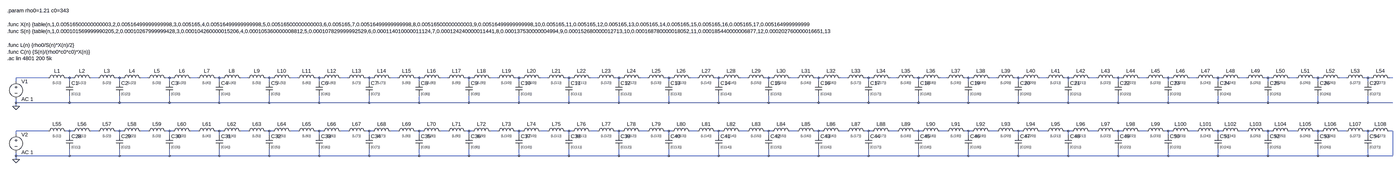
[diagram p0: schematic AC -220722 - Horn.asc, whole sheet]
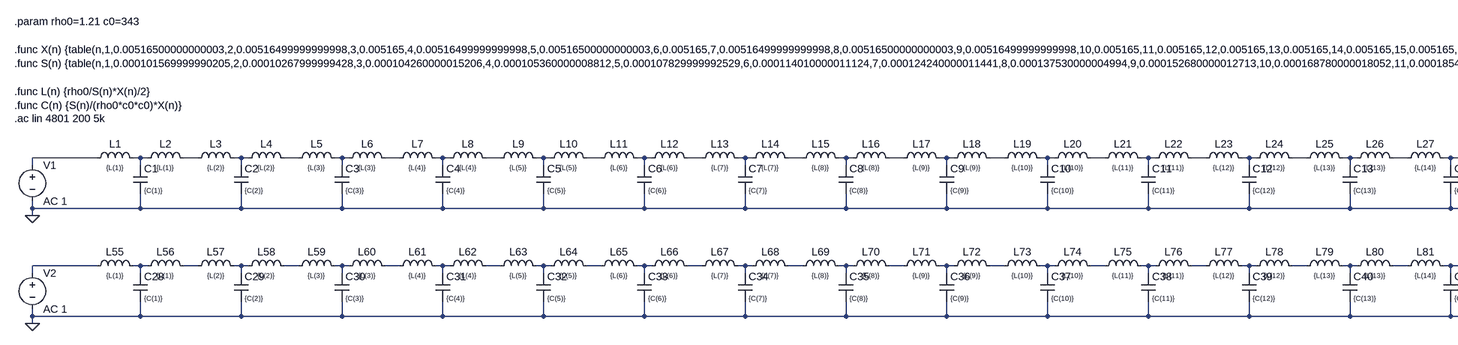
[diagram p1: schematic AC -220722 - Horn.asc, part, row 1 of 1, column 1 of 2]
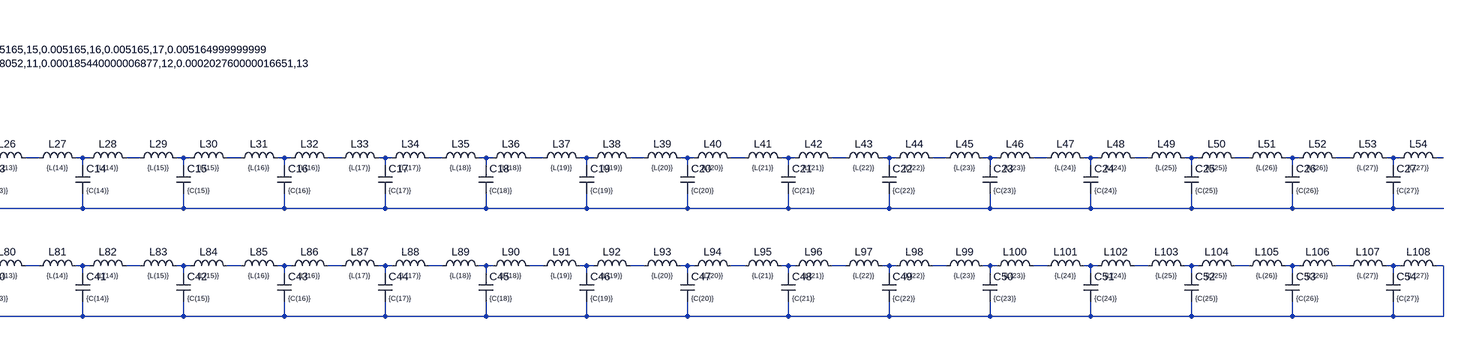
[diagram p2: schematic AC -220722 - Horn.asc, part, row 1 of 1, column 2 of 2]
AC -220722 - Horn.asc, the LTspice schematic file:
Version 4
SHEET 1 9596 1048
WIRE 224 416 80 416
WIRE 320 416 304 416
WIRE 336 416 320 416
WIRE 448 416 416 416
WIRE 544 416 528 416
WIRE 560 416 544 416
WIRE 672 416 640 416
WIRE 768 416 752 416
WIRE 784 416 768 416
WIRE 896 416 864 416
WIRE 992 416 976 416
WIRE 1008 416 992 416
WIRE 1120 416 1088 416
WIRE 1216 416 1200 416
WIRE 1232 416 1216 416
WIRE 1344 416 1312 416
WIRE 1440 416 1424 416
WIRE 1456 416 1440 416
WIRE 1568 416 1536 416
WIRE 1664 416 1648 416
WIRE 1680 416 1664 416
WIRE 1792 416 1760 416
WIRE 1888 416 1872 416
WIRE 1904 416 1888 416
WIRE 2016 416 1984 416
WIRE 2112 416 2096 416
WIRE 2128 416 2112 416
WIRE 2240 416 2208 416
WIRE 2336 416 2320 416
WIRE 2352 416 2336 416
WIRE 2464 416 2432 416
WIRE 2560 416 2544 416
WIRE 2576 416 2560 416
WIRE 2688 416 2656 416
WIRE 2784 416 2768 416
WIRE 2800 416 2784 416
WIRE 2912 416 2880 416
WIRE 3008 416 2992 416
WIRE 3024 416 3008 416
WIRE 3136 416 3104 416
WIRE 3232 416 3216 416
WIRE 3248 416 3232 416
WIRE 3360 416 3328 416
WIRE 3456 416 3440 416
WIRE 3472 416 3456 416
WIRE 3584 416 3552 416
WIRE 3680 416 3664 416
WIRE 3696 416 3680 416
WIRE 3808 416 3776 416
WIRE 3904 416 3888 416
WIRE 3920 416 3904 416
WIRE 4032 416 4000 416
WIRE 4128 416 4112 416
WIRE 4144 416 4128 416
WIRE 4256 416 4224 416
WIRE 4352 416 4336 416
WIRE 4368 416 4352 416
WIRE 4480 416 4448 416
WIRE 4576 416 4560 416
WIRE 4592 416 4576 416
WIRE 4704 416 4672 416
WIRE 4800 416 4784 416
WIRE 4816 416 4800 416
WIRE 4928 416 4896 416
WIRE 5024 416 5008 416
WIRE 5040 416 5024 416
WIRE 5152 416 5120 416
WIRE 5248 416 5232 416
WIRE 5264 416 5248 416
WIRE 5376 416 5344 416
WIRE 5472 416 5456 416
WIRE 5488 416 5472 416
WIRE 5600 416 5568 416
WIRE 5696 416 5680 416
WIRE 5712 416 5696 416
WIRE 5824 416 5792 416
WIRE 5920 416 5904 416
WIRE 5936 416 5920 416
WIRE 6048 416 6016 416
WIRE 6144 416 6128 416
WIRE 6160 416 6144 416
WIRE 6256 416 6240 416
WIRE 80 432 80 416
WIRE 320 432 320 416
WIRE 544 432 544 416
WIRE 768 432 768 416
WIRE 992 432 992 416
WIRE 1216 432 1216 416
WIRE 1440 432 1440 416
WIRE 1664 432 1664 416
WIRE 1888 432 1888 416
WIRE 2112 432 2112 416
WIRE 2336 432 2336 416
WIRE 2560 432 2560 416
WIRE 2784 432 2784 416
WIRE 3008 432 3008 416
WIRE 3232 432 3232 416
WIRE 3456 432 3456 416
WIRE 3680 432 3680 416
WIRE 3904 432 3904 416
WIRE 4128 432 4128 416
WIRE 4352 432 4352 416
WIRE 4576 432 4576 416
WIRE 4800 432 4800 416
WIRE 5024 432 5024 416
WIRE 5248 432 5248 416
WIRE 5472 432 5472 416
WIRE 5696 432 5696 416
WIRE 5920 432 5920 416
WIRE 6144 432 6144 416
WIRE 80 528 80 512
WIRE 320 528 320 496
WIRE 320 528 80 528
WIRE 544 528 544 496
WIRE 544 528 320 528
WIRE 768 528 768 496
WIRE 768 528 544 528
WIRE 992 528 992 496
WIRE 992 528 768 528
WIRE 1216 528 1216 496
WIRE 1216 528 992 528
WIRE 1440 528 1440 496
WIRE 1440 528 1216 528
WIRE 1664 528 1664 496
WIRE 1664 528 1440 528
WIRE 1888 528 1888 496
WIRE 1888 528 1664 528
WIRE 2112 528 2112 496
WIRE 2112 528 1888 528
WIRE 2336 528 2336 496
WIRE 2336 528 2112 528
WIRE 2560 528 2560 496
WIRE 2560 528 2336 528
WIRE 2784 528 2784 496
WIRE 2784 528 2560 528
WIRE 3008 528 3008 496
WIRE 3008 528 2784 528
WIRE 3232 528 3232 496
WIRE 3232 528 3008 528
WIRE 3456 528 3456 496
WIRE 3456 528 3232 528
WIRE 3680 528 3680 496
WIRE 3680 528 3456 528
WIRE 3904 528 3904 496
WIRE 3904 528 3680 528
WIRE 4128 528 4128 496
WIRE 4128 528 3904 528
WIRE 4352 528 4352 496
WIRE 4352 528 4128 528
WIRE 4576 528 4576 496
WIRE 4576 528 4352 528
WIRE 4800 528 4800 496
WIRE 4800 528 4576 528
WIRE 5024 528 5024 496
WIRE 5024 528 4800 528
WIRE 5248 528 5248 496
WIRE 5248 528 5024 528
WIRE 5472 528 5472 496
WIRE 5472 528 5248 528
WIRE 5696 528 5696 496
WIRE 5696 528 5472 528
WIRE 5920 528 5920 496
WIRE 5920 528 5696 528
WIRE 6144 528 6144 496
WIRE 6144 528 5920 528
WIRE 6256 528 6144 528
WIRE 80 544 80 528
WIRE 224 656 80 656
WIRE 320 656 304 656
WIRE 336 656 320 656
WIRE 448 656 416 656
WIRE 544 656 528 656
WIRE 560 656 544 656
WIRE 672 656 640 656
WIRE 768 656 752 656
WIRE 784 656 768 656
WIRE 896 656 864 656
WIRE 992 656 976 656
WIRE 1008 656 992 656
WIRE 1120 656 1088 656
WIRE 1216 656 1200 656
WIRE 1232 656 1216 656
WIRE 1344 656 1312 656
WIRE 1440 656 1424 656
WIRE 1456 656 1440 656
WIRE 1568 656 1536 656
WIRE 1664 656 1648 656
WIRE 1680 656 1664 656
WIRE 1792 656 1760 656
WIRE 1888 656 1872 656
WIRE 1904 656 1888 656
WIRE 2016 656 1984 656
WIRE 2112 656 2096 656
WIRE 2128 656 2112 656
WIRE 2240 656 2208 656
WIRE 2336 656 2320 656
WIRE 2352 656 2336 656
WIRE 2464 656 2432 656
WIRE 2560 656 2544 656
WIRE 2576 656 2560 656
WIRE 2688 656 2656 656
WIRE 2784 656 2768 656
WIRE 2800 656 2784 656
WIRE 2912 656 2880 656
WIRE 3008 656 2992 656
WIRE 3024 656 3008 656
WIRE 3136 656 3104 656
WIRE 3232 656 3216 656
WIRE 3248 656 3232 656
WIRE 3360 656 3328 656
WIRE 3456 656 3440 656
WIRE 3472 656 3456 656
WIRE 3584 656 3552 656
WIRE 3680 656 3664 656
WIRE 3696 656 3680 656
WIRE 3808 656 3776 656
WIRE 3904 656 3888 656
WIRE 3920 656 3904 656
WIRE 4032 656 4000 656
WIRE 4128 656 4112 656
WIRE 4144 656 4128 656
WIRE 4256 656 4224 656
WIRE 4352 656 4336 656
WIRE 4368 656 4352 656
WIRE 4480 656 4448 656
WIRE 4576 656 4560 656
WIRE 4592 656 4576 656
WIRE 4704 656 4672 656
WIRE 4800 656 4784 656
WIRE 4816 656 4800 656
WIRE 4928 656 4896 656
WIRE 5024 656 5008 656
WIRE 5040 656 5024 656
WIRE 5152 656 5120 656
WIRE 5248 656 5232 656
WIRE 5264 656 5248 656
WIRE 5376 656 5344 656
WIRE 5472 656 5456 656
WIRE 5488 656 5472 656
WIRE 5600 656 5568 656
WIRE 5696 656 5680 656
WIRE 5712 656 5696 656
WIRE 5824 656 5792 656
WIRE 5920 656 5904 656
WIRE 5936 656 5920 656
WIRE 6048 656 6016 656
WIRE 6144 656 6128 656
WIRE 6160 656 6144 656
WIRE 6256 656 6240 656
WIRE 80 672 80 656
WIRE 320 672 320 656
WIRE 544 672 544 656
WIRE 768 672 768 656
WIRE 992 672 992 656
WIRE 1216 672 1216 656
WIRE 1440 672 1440 656
WIRE 1664 672 1664 656
WIRE 1888 672 1888 656
WIRE 2112 672 2112 656
WIRE 2336 672 2336 656
WIRE 2560 672 2560 656
WIRE 2784 672 2784 656
WIRE 3008 672 3008 656
WIRE 3232 672 3232 656
WIRE 3456 672 3456 656
WIRE 3680 672 3680 656
WIRE 3904 672 3904 656
WIRE 4128 672 4128 656
WIRE 4352 672 4352 656
WIRE 4576 672 4576 656
WIRE 4800 672 4800 656
WIRE 5024 672 5024 656
WIRE 5248 672 5248 656
WIRE 5472 672 5472 656
WIRE 5696 672 5696 656
WIRE 5920 672 5920 656
WIRE 6144 672 6144 656
WIRE 80 768 80 752
WIRE 320 768 320 736
WIRE 320 768 80 768
WIRE 544 768 544 736
WIRE 544 768 320 768
WIRE 768 768 768 736
WIRE 768 768 544 768
WIRE 992 768 992 736
WIRE 992 768 768 768
WIRE 1216 768 1216 736
WIRE 1216 768 992 768
WIRE 1440 768 1440 736
WIRE 1440 768 1216 768
WIRE 1664 768 1664 736
WIRE 1664 768 1440 768
WIRE 1888 768 1888 736
WIRE 1888 768 1664 768
WIRE 2112 768 2112 736
WIRE 2112 768 1888 768
WIRE 2336 768 2336 736
WIRE 2336 768 2112 768
WIRE 2560 768 2560 736
WIRE 2560 768 2336 768
WIRE 2784 768 2784 736
WIRE 2784 768 2560 768
WIRE 3008 768 3008 736
WIRE 3008 768 2784 768
WIRE 3232 768 3232 736
WIRE 3232 768 3008 768
WIRE 3456 768 3456 736
WIRE 3456 768 3232 768
WIRE 3680 768 3680 736
WIRE 3680 768 3456 768
WIRE 3904 768 3904 736
WIRE 3904 768 3680 768
WIRE 4128 768 4128 736
WIRE 4128 768 3904 768
WIRE 4352 768 4352 736
WIRE 4352 768 4128 768
WIRE 4576 768 4576 736
WIRE 4576 768 4352 768
WIRE 4800 768 4800 736
WIRE 4800 768 4576 768
WIRE 5024 768 5024 736
WIRE 5024 768 4800 768
WIRE 5248 768 5248 736
WIRE 5248 768 5024 768
WIRE 5472 768 5472 736
WIRE 5472 768 5248 768
WIRE 5696 768 5696 736
WIRE 5696 768 5472 768
WIRE 5920 768 5920 736
WIRE 5920 768 5696 768
WIRE 6144 768 6144 736
WIRE 6144 768 5920 768
WIRE 6256 768 6256 656
WIRE 6256 768 6144 768
WIRE 80 784 80 768
FLAG 80 544 0
FLAG 80 784 0
SYMBOL voltage 80 416 R0
SYMATTR InstName V1
SYMATTR Value AC 1
SYMBOL ind 208 432 R270
WINDOW 0 32 56 VTop 2
WINDOW 3 5 56 VBottom 1
SYMATTR InstName L1
SYMATTR Value {L(1)}
SYMBOL ind 320 432 R270
WINDOW 0 32 56 VTop 2
WINDOW 3 5 56 VBottom 1
SYMATTR InstName L2
SYMATTR Value {L(1)}
SYMBOL cap 304 432 R0
WINDOW 3 24 56 Left 1
SYMATTR Value {C(1)}
SYMATTR InstName C1
SYMBOL ind 432 432 R270
WINDOW 0 32 56 VTop 2
WINDOW 3 5 56 VBottom 1
SYMATTR InstName L3
SYMATTR Value {L(2)}
SYMBOL ind 544 432 R270
WINDOW 0 32 56 VTop 2
WINDOW 3 5 56 VBottom 1
SYMATTR InstName L4
SYMATTR Value {L(2)}
SYMBOL cap 528 432 R0
WINDOW 3 24 56 Left 1
SYMATTR Value {C(2)}
SYMATTR InstName C2
SYMBOL ind 656 432 R270
WINDOW 0 32 56 VTop 2
WINDOW 3 5 56 VBottom 1
SYMATTR InstName L5
SYMATTR Value {L(3)}
SYMBOL ind 768 432 R270
WINDOW 0 32 56 VTop 2
WINDOW 3 5 56 VBottom 1
SYMATTR InstName L6
SYMATTR Value {L(3)}
SYMBOL cap 752 432 R0
WINDOW 3 24 56 Left 1
SYMATTR Value {C(3)}
SYMATTR InstName C3
SYMBOL ind 880 432 R270
WINDOW 0 32 56 VTop 2
WINDOW 3 5 56 VBottom 1
SYMATTR InstName L7
SYMATTR Value {L(4)}
SYMBOL ind 992 432 R270
WINDOW 0 32 56 VTop 2
WINDOW 3 5 56 VBottom 1
SYMATTR InstName L8
SYMATTR Value {L(4)}
SYMBOL cap 976 432 R0
WINDOW 3 24 56 Left 1
SYMATTR Value {C(4)}
SYMATTR InstName C4
SYMBOL ind 1104 432 R270
WINDOW 0 32 56 VTop 2
WINDOW 3 5 56 VBottom 1
SYMATTR InstName L9
SYMATTR Value {L(5)}
SYMBOL ind 1216 432 R270
WINDOW 0 32 56 VTop 2
WINDOW 3 5 56 VBottom 1
SYMATTR InstName L10
SYMATTR Value {L(5)}
SYMBOL cap 1200 432 R0
WINDOW 3 24 56 Left 1
SYMATTR Value {C(5)}
SYMATTR InstName C5
SYMBOL ind 1328 432 R270
WINDOW 0 32 56 VTop 2
WINDOW 3 5 56 VBottom 1
SYMATTR InstName L11
SYMATTR Value {L(6)}
SYMBOL ind 1440 432 R270
WINDOW 0 32 56 VTop 2
WINDOW 3 5 56 VBottom 1
SYMATTR InstName L12
SYMATTR Value {L(6)}
SYMBOL cap 1424 432 R0
WINDOW 3 24 56 Left 1
SYMATTR Value {C(6)}
SYMATTR InstName C6
SYMBOL ind 1552 432 R270
WINDOW 0 32 56 VTop 2
WINDOW 3 5 56 VBottom 1
SYMATTR InstName L13
SYMATTR Value {L(7)}
SYMBOL ind 1664 432 R270
WINDOW 0 32 56 VTop 2
WINDOW 3 5 56 VBottom 1
SYMATTR InstName L14
SYMATTR Value {L(7)}
SYMBOL cap 1648 432 R0
WINDOW 3 24 56 Left 1
SYMATTR Value {C(7)}
SYMATTR InstName C7
SYMBOL ind 1776 432 R270
WINDOW 0 32 56 VTop 2
WINDOW 3 5 56 VBottom 1
SYMATTR InstName L15
SYMATTR Value {L(8)}
SYMBOL ind 1888 432 R270
WINDOW 0 32 56 VTop 2
WINDOW 3 5 56 VBottom 1
SYMATTR InstName L16
SYMATTR Value {L(8)}
SYMBOL cap 1872 432 R0
WINDOW 3 24 56 Left 1
SYMATTR Value {C(8)}
SYMATTR InstName C8
SYMBOL ind 2000 432 R270
WINDOW 0 32 56 VTop 2
WINDOW 3 5 56 VBottom 1
SYMATTR InstName L17
SYMATTR Value {L(9)}
SYMBOL ind 2112 432 R270
WINDOW 0 32 56 VTop 2
WINDOW 3 5 56 VBottom 1
SYMATTR InstName L18
SYMATTR Value {L(9)}
SYMBOL cap 2096 432 R0
WINDOW 3 24 56 Left 1
SYMATTR Value {C(9)}
SYMATTR InstName C9
SYMBOL ind 2224 432 R270
WINDOW 0 32 56 VTop 2
WINDOW 3 5 56 VBottom 1
SYMATTR InstName L19
SYMATTR Value {L(10)}
SYMBOL ind 2336 432 R270
WINDOW 0 32 56 VTop 2
WINDOW 3 5 56 VBottom 1
SYMATTR InstName L20
SYMATTR Value {L(10)}
SYMBOL cap 2320 432 R0
WINDOW 3 24 56 Left 1
SYMATTR Value {C(10)}
SYMATTR InstName C10
SYMBOL ind 2448 432 R270
WINDOW 0 32 56 VTop 2
WINDOW 3 5 56 VBottom 1
SYMATTR InstName L21
SYMATTR Value {L(11)}
SYMBOL ind 2560 432 R270
WINDOW 0 32 56 VTop 2
WINDOW 3 5 56 VBottom 1
SYMATTR InstName L22
SYMATTR Value {L(11)}
SYMBOL cap 2544 432 R0
WINDOW 3 24 56 Left 1
SYMATTR Value {C(11)}
SYMATTR InstName C11
SYMBOL ind 2672 432 R270
WINDOW 0 32 56 VTop 2
WINDOW 3 5 56 VBottom 1
SYMATTR InstName L23
SYMATTR Value {L(12)}
SYMBOL ind 2784 432 R270
WINDOW 0 32 56 VTop 2
WINDOW 3 5 56 VBottom 1
SYMATTR InstName L24
SYMATTR Value {L(12)}
SYMBOL cap 2768 432 R0
WINDOW 3 24 56 Left 1
SYMATTR Value {C(12)}
SYMATTR InstName C12
SYMBOL ind 2896 432 R270
WINDOW 0 32 56 VTop 2
WINDOW 3 5 56 VBottom 1
SYMATTR InstName L25
SYMATTR Value {L(13)}
SYMBOL ind 3008 432 R270
WINDOW 0 32 56 VTop 2
WINDOW 3 5 56 VBottom 1
SYMATTR InstName L26
SYMATTR Value {L(13)}
SYMBOL cap 2992 432 R0
WINDOW 3 24 56 Left 1
SYMATTR Value {C(13)}
SYMATTR InstName C13
SYMBOL ind 3120 432 R270
WINDOW 0 32 56 VTop 2
WINDOW 3 5 56 VBottom 1
SYMATTR InstName L27
SYMATTR Value {L(14)}
SYMBOL ind 3232 432 R270
WINDOW 0 32 56 VTop 2
WINDOW 3 5 56 VBottom 1
SYMATTR InstName L28
SYMATTR Value {L(14)}
SYMBOL cap 3216 432 R0
WINDOW 3 24 56 Left 1
SYMATTR Value {C(14)}
SYMATTR InstName C14
SYMBOL ind 3344 432 R270
WINDOW 0 32 56 VTop 2
WINDOW 3 5 56 VBottom 1
SYMATTR InstName L29
SYMATTR Value {L(15)}
SYMBOL ind 3456 432 R270
WINDOW 0 32 56 VTop 2
WINDOW 3 5 56 VBottom 1
SYMATTR InstName L30
SYMATTR Value {L(15)}
SYMBOL cap 3440 432 R0
WINDOW 3 24 56 Left 1
SYMATTR Value {C(15)}
SYMATTR InstName C15
SYMBOL ind 3568 432 R270
WINDOW 0 32 56 VTop 2
WINDOW 3 5 56 VBottom 1
SYMATTR InstName L31
SYMATTR Value {L(16)}
SYMBOL ind 3680 432 R270
WINDOW 0 32 56 VTop 2
WINDOW 3 5 56 VBottom 1
SYMATTR InstName L32
SYMATTR Value {L(16)}
SYMBOL cap 3664 432 R0
WINDOW 3 24 56 Left 1
SYMATTR Value {C(16)}
SYMATTR InstName C16
SYMBOL ind 3792 432 R270
WINDOW 0 32 56 VTop 2
WINDOW 3 5 56 VBottom 1
SYMATTR InstName L33
SYMATTR Value {L(17)}
SYMBOL ind 3904 432 R270
WINDOW 0 32 56 VTop 2
WINDOW 3 5 56 VBottom 1
SYMATTR InstName L34
SYMATTR Value {L(17)}
SYMBOL cap 3888 432 R0
WINDOW 3 24 56 Left 1
SYMATTR Value {C(17)}
SYMATTR InstName C17
SYMBOL ind 4016 432 R270
WINDOW 0 32 56 VTop 2
WINDOW 3 5 56 VBottom 1
SYMATTR InstName L35
SYMATTR Value {L(18)}
SYMBOL ind 4128 432 R270
WINDOW 0 32 56 VTop 2
WINDOW 3 5 56 VBottom 1
SYMATTR InstName L36
SYMATTR Value {L(18)}
SYMBOL cap 4112 432 R0
WINDOW 3 24 56 Left 1
SYMATTR Value {C(18)}
SYMATTR InstName C18
SYMBOL ind 4240 432 R270
WINDOW 0 32 56 VTop 2
WINDOW 3 5 56 VBottom 1
SYMATTR InstName L37
SYMATTR Value {L(19)}
SYMBOL ind 4352 432 R270
WINDOW 0 32 56 VTop 2
WINDOW 3 5 56 VBottom 1
SYMATTR InstName L38
SYMATTR Value {L(19)}
SYMBOL cap 4336 432 R0
WINDOW 3 24 56 Left 1
SYMATTR Value {C(19)}
SYMATTR InstName C19
SYMBOL ind 4464 432 R270
WINDOW 0 32 56 VTop 2
WINDOW 3 5 56 VBottom 1
SYMATTR InstName L39
SYMATTR Value {L(20)}
SYMBOL ind 4576 432 R270
WINDOW 0 32 56 VTop 2
WINDOW 3 5 56 VBottom 1
SYMATTR InstName L40
SYMATTR Value {L(20)}
SYMBOL cap 4560 432 R0
WINDOW 3 24 56 Left 1
SYMATTR Value {C(20)}
SYMATTR InstName C20
SYMBOL ind 4688 432 R270
WINDOW 0 32 56 VTop 2
WINDOW 3 5 56 VBottom 1
SYMATTR InstName L41
SYMATTR Value {L(21)}
SYMBOL ind 4800 432 R270
WINDOW 0 32 56 VTop 2
WINDOW 3 5 56 VBottom 1
SYMATTR InstName L42
SYMATTR Value {L(21)}
SYMBOL cap 4784 432 R0
WINDOW 3 24 56 Left 1
SYMATTR Value {C(21)}
SYMATTR InstName C21
SYMBOL ind 4912 432 R270
WINDOW 0 32 56 VTop 2
WINDOW 3 5 56 VBottom 1
SYMATTR InstName L43
SYMATTR Value {L(22)}
SYMBOL ind 5024 432 R270
WINDOW 0 32 56 VTop 2
WINDOW 3 5 56 VBottom 1
SYMATTR InstName L44
SYMATTR Value {L(22)}
SYMBOL cap 5008 432 R0
WINDOW 3 24 56 Left 1
SYMATTR Value {C(22)}
SYMATTR InstName C22
SYMBOL ind 5136 432 R270
WINDOW 0 32 56 VTop 2
WINDOW 3 5 56 VBottom 1
SYMATTR InstName L45
SYMATTR Value {L(23)}
SYMBOL ind 5248 432 R270
WINDOW 0 32 56 VTop 2
WINDOW 3 5 56 VBottom 1
SYMATTR InstName L46
SYMATTR Value {L(23)}
SYMBOL cap 5232 432 R0
WINDOW 3 24 56 Left 1
SYMATTR Value {C(23)}
SYMATTR InstName C23
SYMBOL ind 5360 432 R270
WINDOW 0 32 56 VTop 2
WINDOW 3 5 56 VBottom 1
SYMATTR InstName L47
SYMATTR Value {L(24)}
SYMBOL ind 5472 432 R270
WINDOW 0 32 56 VTop 2
WINDOW 3 5 56 VBottom 1
SYMATTR InstName L48
SYMATTR Value {L(24)}
SYMBOL cap 5456 432 R0
WINDOW 3 24 56 Left 1
SYMATTR Value {C(24)}
SYMATTR InstName C24
SYMBOL ind 5584 432 R270
WINDOW 0 32 56 VTop 2
WINDOW 3 5 56 VBottom 1
SYMATTR InstName L49
SYMATTR Value {L(25)}
SYMBOL ind 5696 432 R270
WINDOW 0 32 56 VTop 2
WINDOW 3 5 56 VBottom 1
SYMATTR InstName L50
SYMATTR Value {L(25)}
SYMBOL cap 5680 432 R0
WINDOW 3 24 56 Left 1
SYMATTR Value {C(25)}
SYMATTR InstName C25
SYMBOL ind 5808 432 R270
WINDOW 0 32 56 VTop 2
WINDOW 3 5 56 VBottom 1
SYMATTR InstName L51
SYMATTR Value {L(26)}
SYMBOL ind 5920 432 R270
WINDOW 0 32 56 VTop 2
WINDOW 3 5 56 VBottom 1
SYMATTR InstName L52
SYMATTR Value {L(26)}
SYMBOL cap 5904 432 R0
WINDOW 3 24 56 Left 1
SYMATTR Value {C(26)}
SYMATTR InstName C26
SYMBOL ind 6032 432 R270
WINDOW 0 32 56 VTop 2
WINDOW 3 5 56 VBottom 1
SYMATTR InstName L53
SYMATTR Value {L(27)}
SYMBOL ind 6144 432 R270
WINDOW 0 32 56 VTop 2
WINDOW 3 5 56 VBottom 1
SYMATTR InstName L54
SYMATTR Value {L(27)}
SYMBOL cap 6128 432 R0
WINDOW 3 24 56 Left 1
SYMATTR Value {C(27)}
SYMATTR InstName C27
SYMBOL voltage 80 656 R0
SYMATTR InstName V2
SYMATTR Value AC 1
SYMBOL ind 208 672 R270
WINDOW 0 32 56 VTop 2
WINDOW 3 5 56 VBottom 1
SYMATTR InstName L55
SYMATTR Value {L(1)}
SYMBOL ind 320 672 R270
WINDOW 0 32 56 VTop 2
WINDOW 3 5 56 VBottom 1
SYMATTR InstName L56
SYMATTR Value {L(1)}
SYMBOL cap 304 672 R0
WINDOW 3 24 56 Left 1
SYMATTR Value {C(1)}
SYMATTR InstName C28
SYMBOL ind 432 672 R270
WINDOW 0 32 56 VTop 2
WINDOW 3 5 56 VBottom 1
SYMATTR InstName L57
SYMATTR Value {L(2)}
SYMBOL ind 544 672 R270
WINDOW 0 32 56 VTop 2
WINDOW 3 5 56 VBottom 1
SYMATTR InstName L58
SYMATTR Value {L(2)}
SYMBOL cap 528 672 R0
WINDOW 3 24 56 Left 1
SYMATTR Value {C(2)}
SYMATTR InstName C29
SYMBOL ind 656 672 R270
WINDOW 0 32 56 VTop 2
WINDOW 3 5 56 VBottom 1
SYMATTR InstName L59
SYMATTR Value {L(3)}
SYMBOL ind 768 672 R270
WINDOW 0 32 56 VTop 2
WINDOW 3 5 56 VBottom 1
SYMATTR InstName L60
SYMATTR Value {L(3)}
SYMBOL cap 752 672 R0
WINDOW 3 24 56 Left 1
SYMATTR Value {C(3)}
SYMATTR InstName C30
SYMBOL ind 880 672 R270
WINDOW 0 32 56 VTop 2
WINDOW 3 5 56 VBottom 1
SYMATTR InstName L61
SYMATTR Value {L(4)}
SYMBOL ind 992 672 R270
WINDOW 0 32 56 VTop 2
WINDOW 3 5 56 VBottom 1
SYMATTR InstName L62
SYMATTR Value {L(4)}
SYMBOL cap 976 672 R0
WINDOW 3 24 56 Left 1
SYMATTR Value {C(4)}
SYMATTR InstName C31
SYMBOL ind 1104 672 R270
WINDOW 0 32 56 VTop 2
WINDOW 3 5 56 VBottom 1
SYMATTR InstName L63
SYMATTR Value {L(5)}
SYMBOL ind 1216 672 R270
WINDOW 0 32 56 VTop 2
WINDOW 3 5 56 VBottom 1
SYMATTR InstName L64
SYMATTR Value {L(5)}
SYMBOL cap 1200 672 R0
WINDOW 3 24 56 Left 1
SYMATTR Value {C(5)}
SYMATTR InstName C32
SYMBOL ind 1328 672 R270
WINDOW 0 32 56 VTop 2
WINDOW 3 5 56 VBottom 1
SYMATTR InstName L65
SYMATTR Value {L(6)}
SYMBOL ind 1440 672 R270
WINDOW 0 32 56 VTop 2
WINDOW 3 5 56 VBottom 1
SYMATTR InstName L66
SYMATTR Value {L(6)}
SYMBOL cap 1424 672 R0
WINDOW 3 24 56 Left 1
SYMATTR Value {C(6)}
SYMATTR InstName C33
SYMBOL ind 1552 672 R270
WINDOW 0 32 56 VTop 2
WINDOW 3 5 56 VBottom 1
SYMATTR InstName L67
SYMATTR Value {L(7)}
SYMBOL ind 1664 672 R270
WINDOW 0 32 56 VTop 2
WINDOW 3 5 56 VBottom 1
SYMATTR InstName L68
SYMATTR Value {L(7)}
SYMBOL cap 1648 672 R0
WINDOW 3 24 56 Left 1
SYMATTR Value {C(7)}
SYMATTR InstName C34
SYMBOL ind 1776 672 R270
WINDOW 0 32 56 VTop 2
WINDOW 3 5 56 VBottom 1
SYMATTR InstName L69
SYMATTR Value {L(8)}
SYMBOL ind 1888 672 R270
WINDOW 0 32 56 VTop 2
WINDOW 3 5 56 VBottom 1
SYMATTR InstName L70
SYMATTR Value {L(8)}
SYMBOL cap 1872 672 R0
WINDOW 3 24 56 Left 1
SYMATTR Value {C(8)}
SYMATTR InstName C35
SYMBOL ind 2000 672 R270
WINDOW 0 32 56 VTop 2
WINDOW 3 5 56 VBottom 1
SYMATTR InstName L71
SYMATTR Value {L(9)}
SYMBOL ind 2112 672 R270
WINDOW 0 32 56 VTop 2
WINDOW 3 5 56 VBottom 1
SYMATTR InstName L72
SYMATTR Value {L(9)}
SYMBOL cap 2096 672 R0
WINDOW 3 24 56 Left 1
SYMATTR Value {C(9)}
SYMATTR InstName C36
SYMBOL ind 2224 672 R270
WINDOW 0 32 56 VTop 2
WINDOW 3 5 56 VBottom 1
SYMATTR InstName L73
SYMATTR Value {L(10)}
SYMBOL ind 2336 672 R270
WINDOW 0 32 56 VTop 2
WINDOW 3 5 56 VBottom 1
SYMATTR InstName L74
SYMATTR Value {L(10)}
SYMBOL cap 2320 672 R0
WINDOW 3 24 56 Left 1
SYMATTR Value {C(10)}
SYMATTR InstName C37
SYMBOL ind 2448 672 R270
WINDOW 0 32 56 VTop 2
WINDOW 3 5 56 VBottom 1
SYMATTR InstName L75
SYMATTR Value {L(11)}
SYMBOL ind 2560 672 R270
WINDOW 0 32 56 VTop 2
WINDOW 3 5 56 VBottom 1
SYMATTR InstName L76
SYMATTR Value {L(11)}
SYMBOL cap 2544 672 R0
WINDOW 3 24 56 Left 1
SYMATTR Value {C(11)}
SYMATTR InstName C38
SYMBOL ind 2672 672 R270
WINDOW 0 32 56 VTop 2
WINDOW 3 5 56 VBottom 1
SYMATTR InstName L77
SYMATTR Value {L(12)}
SYMBOL ind 2784 672 R270
WINDOW 0 32 56 VTop 2
WINDOW 3 5 56 VBottom 1
SYMATTR InstName L78
SYMATTR Value {L(12)}
SYMBOL cap 2768 672 R0
WINDOW 3 24 56 Left 1
SYMATTR Value {C(12)}
SYMATTR InstName C39
SYMBOL ind 2896 672 R270
WINDOW 0 32 56 VTop 2
WINDOW 3 5 56 VBottom 1
SYMATTR InstName L79
SYMATTR Value {L(13)}
SYMBOL ind 3008 672 R270
WINDOW 0 32 56 VTop 2
WINDOW 3 5 56 VBottom 1
SYMATTR InstName L80
SYMATTR Value {L(13)}
SYMBOL cap 2992 672 R0
WINDOW 3 24 56 Left 1
SYMATTR Value {C(13)}
SYMATTR InstName C40
SYMBOL ind 3120 672 R270
WINDOW 0 32 56 VTop 2
WINDOW 3 5 56 VBottom 1
SYMATTR InstName L81
SYMATTR Value {L(14)}
SYMBOL ind 3232 672 R270
WINDOW 0 32 56 VTop 2
WINDOW 3 5 56 VBottom 1
SYMATTR InstName L82
SYMATTR Value {L(14)}
SYMBOL cap 3216 672 R0
WINDOW 3 24 56 Left 1
SYMATTR Value {C(14)}
SYMATTR InstName C41
SYMBOL ind 3344 672 R270
WINDOW 0 32 56 VTop 2
WINDOW 3 5 56 VBottom 1
SYMATTR InstName L83
SYMATTR Value {L(15)}
SYMBOL ind 3456 672 R270
WINDOW 0 32 56 VTop 2
WINDOW 3 5 56 VBottom 1
SYMATTR InstName L84
SYMATTR Value {L(15)}
SYMBOL cap 3440 672 R0
WINDOW 3 24 56 Left 1
SYMATTR Value {C(15)}
SYMATTR InstName C42
SYMBOL ind 3568 672 R270
WINDOW 0 32 56 VTop 2
WINDOW 3 5 56 VBottom 1
SYMATTR InstName L85
SYMATTR Value {L(16)}
SYMBOL ind 3680 672 R270
WINDOW 0 32 56 VTop 2
WINDOW 3 5 56 VBottom 1
SYMATTR InstName L86
SYMATTR Value {L(16)}
SYMBOL cap 3664 672 R0
WINDOW 3 24 56 Left 1
SYMATTR Value {C(16)}
SYMATTR InstName C43
SYMBOL ind 3792 672 R270
WINDOW 0 32 56 VTop 2
WINDOW 3 5 56 VBottom 1
SYMATTR InstName L87
SYMATTR Value {L(17)}
SYMBOL ind 3904 672 R270
WINDOW 0 32 56 VTop 2
WINDOW 3 5 56 VBottom 1
SYMATTR InstName L88
SYMATTR Value {L(17)}
SYMBOL cap 3888 672 R0
WINDOW 3 24 56 Left 1
SYMATTR Value {C(17)}
SYMATTR InstName C44
SYMBOL ind 4016 672 R270
WINDOW 0 32 56 VTop 2
WINDOW 3 5 56 VBottom 1
SYMATTR InstName L89
SYMATTR Value {L(18)}
SYMBOL ind 4128 672 R270
WINDOW 0 32 56 VTop 2
WINDOW 3 5 56 VBottom 1
SYMATTR InstName L90
SYMATTR Value {L(18)}
SYMBOL cap 4112 672 R0
WINDOW 3 24 56 Left 1
SYMATTR Value {C(18)}
SYMATTR InstName C45
SYMBOL ind 4240 672 R270
WINDOW 0 32 56 VTop 2
WINDOW 3 5 56 VBottom 1
SYMATTR InstName L91
SYMATTR Value {L(19)}
SYMBOL ind 4352 672 R270
WINDOW 0 32 56 VTop 2
WINDOW 3 5 56 VBottom 1
SYMATTR InstName L92
SYMATTR Value {L(19)}
SYMBOL cap 4336 672 R0
WINDOW 3 24 56 Left 1
SYMATTR Value {C(19)}
SYMATTR InstName C46
SYMBOL ind 4464 672 R270
WINDOW 0 32 56 VTop 2
WINDOW 3 5 56 VBottom 1
SYMATTR InstName L93
SYMATTR Value {L(20)}
SYMBOL ind 4576 672 R270
WINDOW 0 32 56 VTop 2
WINDOW 3 5 56 VBottom 1
SYMATTR InstName L94
SYMATTR Value {L(20)}
SYMBOL cap 4560 672 R0
WINDOW 3 24 56 Left 1
SYMATTR Value {C(20)}
SYMATTR InstName C47
SYMBOL ind 4688 672 R270
WINDOW 0 32 56 VTop 2
WINDOW 3 5 56 VBottom 1
SYMATTR InstName L95
SYMATTR Value {L(21)}
SYMBOL ind 4800 672 R270
WINDOW 0 32 56 VTop 2
WINDOW 3 5 56 VBottom 1
SYMATTR InstName L96
SYMATTR Value {L(21)}
SYMBOL cap 4784 672 R0
WINDOW 3 24 56 Left 1
SYMATTR Value {C(21)}
SYMATTR InstName C48
SYMBOL ind 4912 672 R270
WINDOW 0 32 56 VTop 2
WINDOW 3 5 56 VBottom 1
SYMATTR InstName L97
SYMATTR Value {L(22)}
SYMBOL ind 5024 672 R270
WINDOW 0 32 56 VTop 2
WINDOW 3 5 56 VBottom 1
SYMATTR InstName L98
SYMATTR Value {L(22)}
SYMBOL cap 5008 672 R0
WINDOW 3 24 56 Left 1
SYMATTR Value {C(22)}
SYMATTR InstName C49
SYMBOL ind 5136 672 R270
WINDOW 0 32 56 VTop 2
WINDOW 3 5 56 VBottom 1
SYMATTR InstName L99
SYMATTR Value {L(23)}
SYMBOL ind 5248 672 R270
WINDOW 0 32 56 VTop 2
WINDOW 3 5 56 VBottom 1
SYMATTR InstName L100
SYMATTR Value {L(23)}
SYMBOL cap 5232 672 R0
WINDOW 3 24 56 Left 1
SYMATTR Value {C(23)}
SYMATTR InstName C50
SYMBOL ind 5360 672 R270
WINDOW 0 32 56 VTop 2
WINDOW 3 5 56 VBottom 1
SYMATTR InstName L101
SYMATTR Value {L(24)}
SYMBOL ind 5472 672 R270
WINDOW 0 32 56 VTop 2
WINDOW 3 5 56 VBottom 1
SYMATTR InstName L102
SYMATTR Value {L(24)}
SYMBOL cap 5456 672 R0
WINDOW 3 24 56 Left 1
SYMATTR Value {C(24)}
SYMATTR InstName C51
SYMBOL ind 5584 672 R270
WINDOW 0 32 56 VTop 2
WINDOW 3 5 56 VBottom 1
SYMATTR InstName L103
SYMATTR Value {L(25)}
SYMBOL ind 5696 672 R270
WINDOW 0 32 56 VTop 2
WINDOW 3 5 56 VBottom 1
SYMATTR InstName L104
SYMATTR Value {L(25)}
SYMBOL cap 5680 672 R0
WINDOW 3 24 56 Left 1
SYMATTR Value {C(25)}
SYMATTR InstName C52
SYMBOL ind 5808 672 R270
WINDOW 0 32 56 VTop 2
WINDOW 3 5 56 VBottom 1
SYMATTR InstName L105
SYMATTR Value {L(26)}
SYMBOL ind 5920 672 R270
WINDOW 0 32 56 VTop 2
WINDOW 3 5 56 VBottom 1
SYMATTR InstName L106
SYMATTR Value {L(26)}
SYMBOL cap 5904 672 R0
WINDOW 3 24 56 Left 1
SYMATTR Value {C(26)}
SYMATTR InstName C53
SYMBOL ind 6032 672 R270
WINDOW 0 32 56 VTop 2
WINDOW 3 5 56 VBottom 1
SYMATTR InstName L107
SYMATTR Value {L(27)}
SYMBOL ind 6144 672 R270
WINDOW 0 32 56 VTop 2
WINDOW 3 5 56 VBottom 1
SYMATTR InstName L108
SYMATTR Value {L(27)}
SYMBOL cap 6128 672 R0
WINDOW 3 24 56 Left 1
SYMATTR Value {C(27)}
SYMATTR InstName C54
TEXT 40 112 Left 2 !.param rho0=1.21 c0=343\n \n.func X(n) {table(n,1,0.00516500000000003,2,0.00516499999999998,3,0.005165,4,0.00516499999999998,5,0.00516500000000003,6,0.005165,7,0.00516499999999998,8,0.00516500000000003,9,0.00516499999999998,10,0.005165,11,0.005165,12,0.005165,13,0.005165,14,0.005165,15,0.005165,16,0.005165,17,0.00516499999999998,18,0.00516500000000003,19,0.005,20,0.005,21,0.005,22,0.005,23,0.005,24,0.005,25,0.00499999999999995,26,0.005,27,0.005)}\n.func S(n) {table(n,1,0.000101569999990205,2,0.00010267999999428,3,0.000104260000015206,4,0.000105360000008812,5,0.000107829999992529,6,0.000114010000011124,7,0.000124240000011441,8,0.000137530000004994,9,0.000152680000012713,10,0.000168780000018052,11,0.000185440000006877,12,0.000202760000016651,13,0.000221379999987761,14,0.000242350000017738,15,0.000266620000003016,16,0.00029481999997399,17,0.000327350000158122,18,0.000363850000046359,19,0.000406440000084485,20,0.000427330000332941,21,0.000496469999910017,22,0.000592849999906204,23,0.000724820000043707,24,0.000911000000046875,25,0.00116684999984727,26,0.00147168000025428,27,0.0017486199997878)}\n \n.func L(n) {rho0/S(n)*X(n)/2}\n.func C(n) {S(n)/(rho0*c0*c0)*X(n)}
TEXT 40 328 Left 2 !.ac lin 4801 200 5k

The netlist it stands for:
* AC -220722 - Horn.asc
V1 N001 0 AC 1
L1 N001 N002 {L(1)}
L2 N002 N003 {L(1)}
C1 N002 0 {C(1)}
L3 N003 N004 {L(2)}
L4 N004 N005 {L(2)}
C2 N004 0 {C(2)}
L5 N005 N006 {L(3)}
L6 N006 N007 {L(3)}
C3 N006 0 {C(3)}
L7 N007 N008 {L(4)}
L8 N008 N009 {L(4)}
C4 N008 0 {C(4)}
L9 N009 N010 {L(5)}
L10 N010 N011 {L(5)}
C5 N010 0 {C(5)}
L11 N011 N012 {L(6)}
L12 N012 N013 {L(6)}
C6 N012 0 {C(6)}
L13 N013 N014 {L(7)}
L14 N014 N015 {L(7)}
C7 N014 0 {C(7)}
L15 N015 N016 {L(8)}
L16 N016 N017 {L(8)}
C8 N016 0 {C(8)}
L17 N017 N018 {L(9)}
L18 N018 N019 {L(9)}
C9 N018 0 {C(9)}
L19 N019 N020 {L(10)}
L20 N020 N021 {L(10)}
C10 N020 0 {C(10)}
L21 N021 N022 {L(11)}
L22 N022 N023 {L(11)}
C11 N022 0 {C(11)}
L23 N023 N024 {L(12)}
L24 N024 N025 {L(12)}
C12 N024 0 {C(12)}
L25 N025 N026 {L(13)}
L26 N026 N027 {L(13)}
C13 N026 0 {C(13)}
L27 N027 N028 {L(14)}
L28 N028 N029 {L(14)}
C14 N028 0 {C(14)}
L29 N029 N030 {L(15)}
L30 N030 N031 {L(15)}
C15 N030 0 {C(15)}
L31 N031 N032 {L(16)}
L32 N032 N033 {L(16)}
C16 N032 0 {C(16)}
L33 N033 N034 {L(17)}
L34 N034 N035 {L(17)}
C17 N034 0 {C(17)}
L35 N035 N036 {L(18)}
L36 N036 N037 {L(18)}
C18 N036 0 {C(18)}
L37 N037 N038 {L(19)}
L38 N038 N039 {L(19)}
C19 N038 0 {C(19)}
L39 N039 N040 {L(20)}
L40 N040 N041 {L(20)}
C20 N040 0 {C(20)}
L41 N041 N042 {L(21)}
L42 N042 N043 {L(21)}
C21 N042 0 {C(21)}
L43 N043 N044 {L(22)}
L44 N044 N045 {L(22)}
C22 N044 0 {C(22)}
L45 N045 N046 {L(23)}
L46 N046 N047 {L(23)}
C23 N046 0 {C(23)}
L47 N047 N048 {L(24)}
L48 N048 N049 {L(24)}
C24 N048 0 {C(24)}
L49 N049 N050 {L(25)}
L50 N050 N051 {L(25)}
C25 N050 0 {C(25)}
L51 N051 N052 {L(26)}
L52 N052 N053 {L(26)}
C26 N052 0 {C(26)}
L53 N053 N054 {L(27)}
L54 N054 N055 {L(27)}
C27 N054 0 {C(27)}
V2 N056 0 AC 1
L55 N056 N057 {L(1)}
L56 N057 N058 {L(1)}
C28 N057 0 {C(1)}
L57 N058 N059 {L(2)}
L58 N059 N060 {L(2)}
C29 N059 0 {C(2)}
L59 N060 N061 {L(3)}
L60 N061 N062 {L(3)}
C30 N061 0 {C(3)}
L61 N062 N063 {L(4)}
L62 N063 N064 {L(4)}
C31 N063 0 {C(4)}
L63 N064 N065 {L(5)}
L64 N065 N066 {L(5)}
C32 N065 0 {C(5)}
L65 N066 N067 {L(6)}
L66 N067 N068 {L(6)}
C33 N067 0 {C(6)}
L67 N068 N069 {L(7)}
L68 N069 N070 {L(7)}
C34 N069 0 {C(7)}
L69 N070 N071 {L(8)}
L70 N071 N072 {L(8)}
C35 N071 0 {C(8)}
L71 N072 N073 {L(9)}
L72 N073 N074 {L(9)}
C36 N073 0 {C(9)}
L73 N074 N075 {L(10)}
L74 N075 N076 {L(10)}
C37 N075 0 {C(10)}
L75 N076 N077 {L(11)}
L76 N077 N078 {L(11)}
C38 N077 0 {C(11)}
L77 N078 N079 {L(12)}
L78 N079 N080 {L(12)}
C39 N079 0 {C(12)}
L79 N080 N081 {L(13)}
L80 N081 N082 {L(13)}
C40 N081 0 {C(13)}
L81 N082 N083 {L(14)}
L82 N083 N084 {L(14)}
C41 N083 0 {C(14)}
L83 N084 N085 {L(15)}
L84 N085 N086 {L(15)}
C42 N085 0 {C(15)}
L85 N086 N087 {L(16)}
L86 N087 N088 {L(16)}
C43 N087 0 {C(16)}
L87 N088 N089 {L(17)}
L88 N089 N090 {L(17)}
C44 N089 0 {C(17)}
L89 N090 N091 {L(18)}
L90 N091 N092 {L(18)}
C45 N091 0 {C(18)}
L91 N092 N093 {L(19)}
L92 N093 N094 {L(19)}
C46 N093 0 {C(19)}
L93 N094 N095 {L(20)}
L94 N095 N096 {L(20)}
C47 N095 0 {C(20)}
L95 N096 N097 {L(21)}
L96 N097 N098 {L(21)}
C48 N097 0 {C(21)}
L97 N098 N099 {L(22)}
L98 N099 N100 {L(22)}
C49 N099 0 {C(22)}
L99 N100 N101 {L(23)}
L100 N101 N102 {L(23)}
C50 N101 0 {C(23)}
L101 N102 N103 {L(24)}
L102 N103 N104 {L(24)}
C51 N103 0 {C(24)}
L103 N104 N105 {L(25)}
L104 N105 N106 {L(25)}
C52 N105 0 {C(25)}
L105 N106 N107 {L(26)}
L106 N107 N108 {L(26)}
C53 N107 0 {C(26)}
L107 N108 N109 {L(27)}
L108 N109 0 {L(27)}
C54 N109 0 {C(27)}
.param rho0=1.21 c0=343
.func X(n) {table(n,1,0.00516500000000003,2,0.00516499999999998,3,0.005165,4,0.00516499999999998,5,0.00516500000000003,6,0.005165,7,0.00516499999999998,8,0.00516500000000003,9,0.00516499999999998,10,0.005165,11,0.005165,12,0.005165,13,0.005165,14,0.005165,15,0.005165,16,0.005165,17,0.00516499999999998,18,0.00516500000000003,19,0.005,20,0.005,21,0.005,22,0.005,23,0.005,24,0.005,25,0.00499999999999995,26,0.005,27,0.005)}
.func S(n) {table(n,1,0.000101569999990205,2,0.00010267999999428,3,0.000104260000015206,4,0.000105360000008812,5,0.000107829999992529,6,0.000114010000011124,7,0.000124240000011441,8,0.000137530000004994,9,0.000152680000012713,10,0.000168780000018052,11,0.000185440000006877,12,0.000202760000016651,13,0.000221379999987761,14,0.000242350000017738,15,0.000266620000003016,16,0.00029481999997399,17,0.000327350000158122,18,0.000363850000046359,19,0.000406440000084485,20,0.000427330000332941,21,0.000496469999910017,22,0.000592849999906204,23,0.000724820000043707,24,0.000911000000046875,25,0.00116684999984727,26,0.00147168000025428,27,0.0017486199997878)}
.func L(n) {rho0/S(n)*X(n)/2}
.func C(n) {S(n)/(rho0*c0*c0)*X(n)}
.ac lin 4801 200 5k
.backanno
.end